# EAGLE design main (EAGLE 7.2.0)
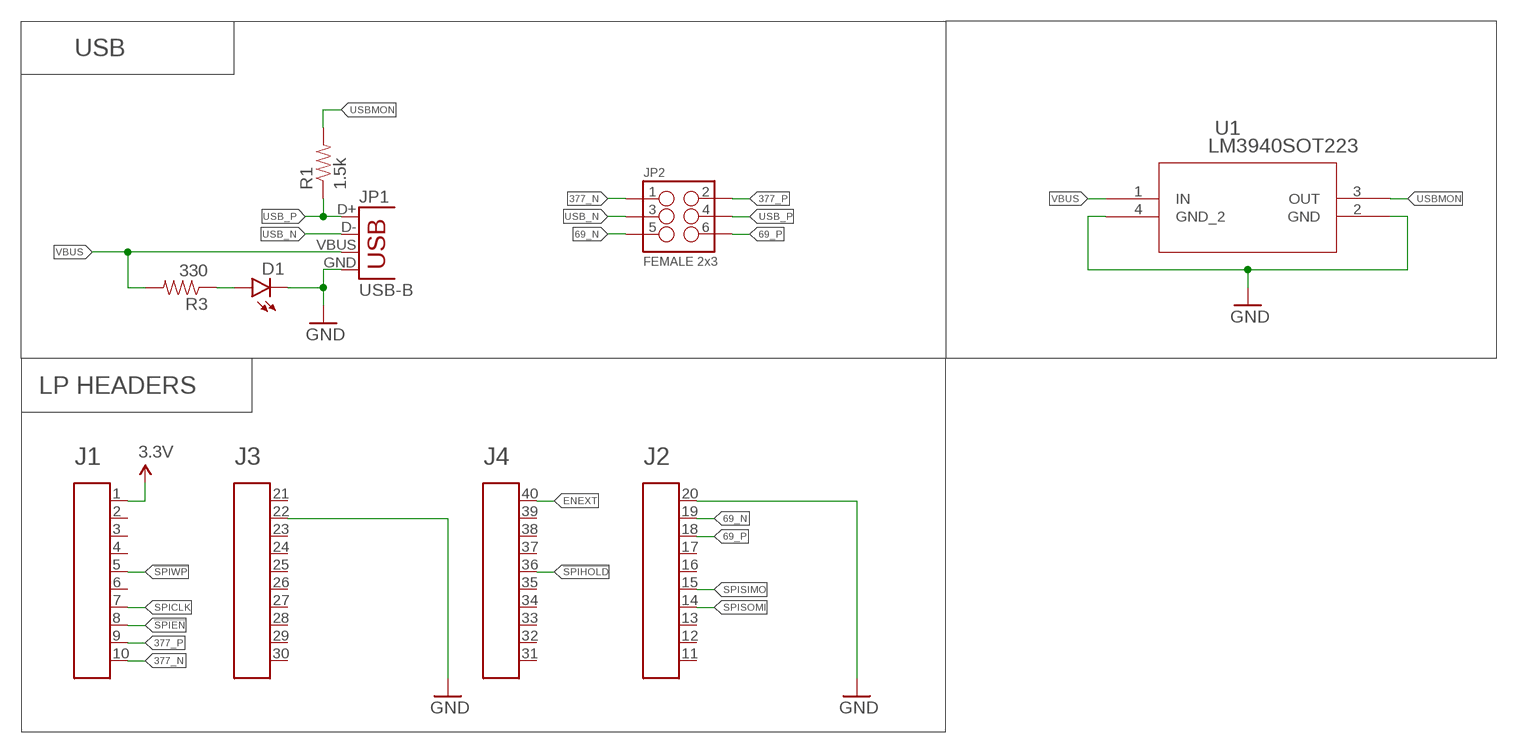
[diagram p0: schematic, sheet 1]

## Parts
A1  HEADER4X10-BOOSTERPACK  [4X10-BOOSTERPACK]
D1  LED3MM  [LED3MM]
JP1  USB-B  USBPTH  [USB-B-PTH]
JP2  FEMALE 2x3  M03X2FEMALE  [2X3]
R1  1.5k  1KOHM-1/4W-5%(PTH)  [AXIAL-0.3]
R3  330  1KOHM-1/4W-5%(PTH)  [AXIAL-0.3]
U1  LM3940SOT223  [DCY]

## Nets
3.3V: A1.1
69_N: A1.19 JP2.5
69_P: A1.18 JP2.6
377_N: A1.10 JP2.1
377_P: A1.9 JP2.2
!SPIEN!: A1.8
!SPIHOLD!: A1.36
!SPIWP!: A1.5
ENEXT: A1.40
GND: A1.20 A1.22 D1.K(C) JP1.GND U1.2(GND) U1.4(GND_2)
N$1: D1.A R3.P$1
SPICLK: A1.7
SPISIMO: A1.15
SPISOMI: A1.14
USB_N: JP1.D- JP2.3
USB_P: JP1.D+ JP2.4 R1.P$1
USBMON: R1.P$2 U1.3(OUT)
VBUS: JP1.VBUS R3.P$2 U1.1(IN)
Unconnected: A1.2 A1.3 A1.4 A1.6 A1.11 A1.12 A1.13 A1.16 A1.17 A1.21 A1.23 A1.24 A1.25 A1.26 A1.27 A1.28 A1.29 A1.30 A1.31 A1.32 A1.33 A1.34 A1.35 A1.37 A1.38 A1.39

## Notes on the sheet
- USB
- LP HEADERS

## Library data of the parts
A1 = EAGLE_BoosterPack_Library:HEADER4X10-BOOSTERPACK
D1 = SparkFun-LED:LED: LEDs Standard schematic elements and footprints for 5mm, 3mm, 1206, and 0603 sized LEDs. 5mm - Spark Fun Electronics SKU : COM-00529 (and others)
JP1 = SparkFun-Connectors:USB: USB Connectors USB-B-PTH is fully proven SKU : PRT-00139/CONN-08278 USB-miniB is fully proven SKU : PRT-00587 USB-A-PCB is untested. USB-A-H is throughly reviewed, but untested. Spark Fun Electronics SKU : PRT-00437 USB-B-SMT is throughly reviewed, but untested. Needs silkscreen touching up. USB-A-S has not been used/tested USB-MB-H has not been used/tested USB-MICROB has been used. CONN-09505; PROD_ID: CONN-08278
JP2 = SparkFun-Connectors:M03X2: 2x3 .1" header. Shrouded, with keying- CONN-10681 SMT- CONN-11415 Pogo pins- HW-11044; PROD_ID: CONN-11566
R1 R3 = SparkFun-Resistors:1KOHM-1/4W-5%(PTH): RES-08380; PROD_ID: RES-08380; VALE: 1k
U1 = ControllerCard:LM3940

## Board
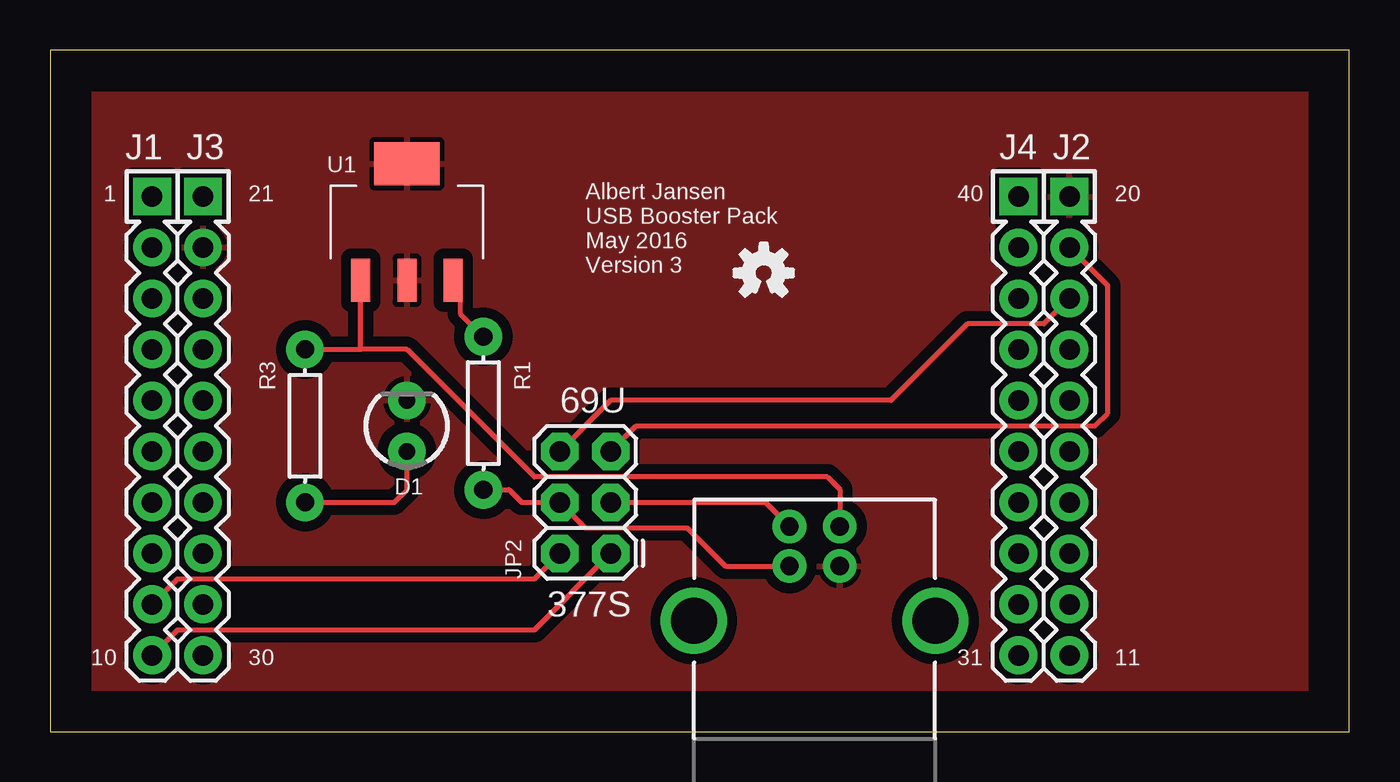
[diagram p1: board, top side]

Size 64.75 x 33.96 mm. Coordinates in mm from the lower left corner, seen from the top.
Outline: 0,0 64.75,0 64.75,33.96 0,33.96 0,0
Copper layers (1*16): Top 0.035mm / dielectric 1.5mm / Bottom 0.035mm
Design rules "Humber Safe DRU": minimum track width 10mil, minimum drill 20mil, track to track 20mil, track to pad 20mil, pad to pad 8mil, via to via 8mil, smd to smd 8mil, copper to edge 80mil, drill to drill 8mil, minimum pad ring 12mil, minimum via ring 10mil, stop-mask expansion 4mil, vias tented up to drill 25mil, thermal gap 10mil

### Footprints (pad centres in the part's own frame; a part is rotated, then mirrored left to right if it is on the bottom)
4X10-BOOSTERPACK = drill 1.016 pad 1.88 square: 1 0,10.16; 20 45.72,10.16; 21 2.54,10.16; 40 43.18,10.16 | drill 1.016 pad 1.88: 2 0,7.62; 3 0,5.08; 4 0,2.54; 5 0,0; 6 0,-2.54; 7 0,-5.08; 8 0,-7.62; 9 0,-10.16; 10 0,-12.7; 11 45.72,-12.7; 12 45.72,-10.16; 13 45.72,-7.62; 14 45.72,-5.08; 15 45.72,-2.54; 16 45.72,0; 17 45.72,2.54; 18 45.72,5.08; 19 45.72,7.62; 22 2.54,7.62; 23 2.54,5.08; 24 2.54,2.54; 25 2.54,0; 26 2.54,-2.54; 27 2.54,-5.08; 28 2.54,-7.62; 29 2.54,-10.16; 30 2.54,-12.7; 31 43.18,-12.7; 32 43.18,-10.16; 33 43.18,-7.62; 34 43.18,-5.08; 35 43.18,-2.54; 36 43.18,0; 37 43.18,2.54; 38 43.18,5.08; 39 43.18,7.62
LED3MM = drill 0.813 pad 1.88: A -1.27,0; K 1.27,0
USB-B-PTH = drill 0.914 pad 1.676: D+ 0,1.25; D- 1.981,1.25; GND 0,-1.25; VBUS 1.981,-1.25 | drill 2.286: S1 -2.718,-6.02; S2 -2.718,6.02
2X3 = drill 1.016 pad 1.88 octagon: 1 0,0; 2 0,2.54; 3 2.54,0; 4 2.54,2.54; 5 5.08,0; 6 5.08,2.54
AXIAL-0.3 = drill 0.9 pad 1.88: P$1 -3.81,0; P$2 3.81,0
DCY = smd 0.95 x 2.15: 1 -2.3,-2.9; 2 0,-2.9; 3 2.3,-2.9 | smd 3.25 x 2.15: 4 0,2.9

### Placement (x,y rotation side)
A1  5.08,16.51 0 top
D1  17.78,15.24 90 top
JP1  38.1,8.26 90 top
JP2  27.94,8.89 90 top
R1  21.59,15.88 90 top
R3  12.7,15.24 90 top
U1  17.78,25.4 0 top
U$1  [OSHW-LOGO-S]  35.56,22.86 0 top

### Tracks (layer width: path | path; a pad name or v marks a point on that pad's centre or on a via)
69_N
  Top 0.254: JP2.5 29.21,15.24 52.07,15.24 52.7,15.88 52.7,22.23 A1.19
69_P
  Top 0.254: A1.18 49.53,20.32 45.72,20.32 41.91,16.51 27.94,16.51 JP2.6
377_N
  Top 0.254: A1.10 6.35,5.08 24.13,5.08 JP2.1
377_P
  Top 0.254: A1.9 6.35,7.62 24.13,7.62 JP2.2
GND
  pour Top (isolate 0.406): 1.27,33.02 63.5,33.02 63.5,1.27 1.27,1.27
N$1
  Top 0.254: R3.P$1 17.14,11.43 17.78,12.06 D1.A
USB_N
  Top 0.254: JP2.3 35.66,11.43 JP1.D-
USB_P
  Top 0.254: JP1.D+ 33.66,8.26 31.75,10.16 26.67,10.16 JP2.4 23.5,11.43 22.86,12.06 R1.P$1
USBMON
  Top 0.254: U1.3 20.44,22.86 20.44,20.84 R1.P$2
VBUS
  Top 0.254: R3.P$2 15.48,19.05 | 15.48,19.05 U1.1 | JP1.VBUS 39.35,12.09 38.73,12.7 24.13,12.7 17.78,19.05 15.48,19.05

### Text on the board
tPlace: Albert Jansen / USB Booster Pack / May 2016 / Version 3
tNames: 69U | 377S